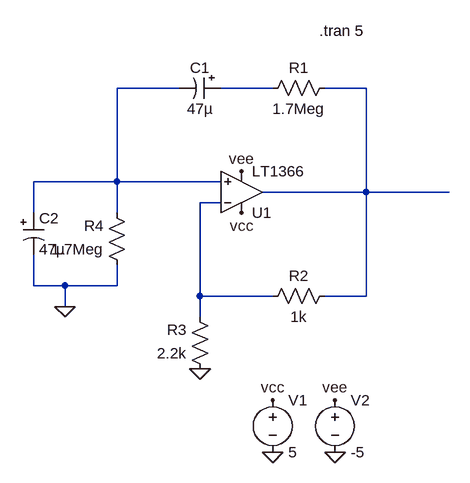
[diagram p0: schematic Draft34.asc]
Draft34.asc, the LTspice schematic file:
Version 4
SHEET 1 880 736
WIRE 304 160 208 160
WIRE 448 160 368 160
WIRE 592 160 528 160
WIRE 208 304 208 160
WIRE 208 304 80 304
WIRE 368 304 208 304
WIRE 592 320 592 160
WIRE 592 320 432 320
WIRE 720 320 592 320
WIRE 368 336 336 336
WIRE 80 352 80 304
WIRE 208 352 208 304
WIRE 80 464 80 416
WIRE 128 464 80 464
WIRE 208 464 208 432
WIRE 208 464 128 464
WIRE 336 480 336 336
WIRE 448 480 336 480
WIRE 592 480 592 320
WIRE 592 480 528 480
WIRE 128 496 128 464
WIRE 336 512 336 480
FLAG 336 592 0
FLAG 128 496 0
FLAG 544 720 0
FLAG 448 720 0
FLAG 448 640 vcc
FLAG 544 640 vee
FLAG 400 352 vcc
FLAG 400 288 vee
SYMBOL Opamps/LT1366 400 384 M180
SYMATTR InstName U1
SYMBOL res 544 144 R90
WINDOW 0 0 56 VBottom 2
WINDOW 3 32 56 VTop 2
SYMATTR InstName R1
SYMATTR Value 1.7Meg
SYMBOL res 544 464 R90
WINDOW 0 0 56 VBottom 2
WINDOW 3 32 56 VTop 2
SYMATTR InstName R2
SYMATTR Value 1k
SYMBOL res 352 608 R180
WINDOW 0 36 76 Left 2
WINDOW 3 36 40 Left 2
SYMATTR InstName R3
SYMATTR Value 2.2k
SYMBOL res 224 448 R180
WINDOW 0 36 76 Left 2
WINDOW 3 36 40 Left 2
SYMATTR InstName R4
SYMATTR Value 1.7Meg
SYMBOL polcap 368 144 R90
WINDOW 0 0 32 VBottom 2
WINDOW 3 32 32 VTop 2
SYMATTR InstName C1
SYMATTR Value 47µ
SYMBOL polcap 64 352 R0
SYMATTR InstName C2
SYMATTR Value 47µ
SYMBOL voltage 448 624 R0
SYMATTR InstName V1
SYMATTR Value 5
SYMBOL voltage 544 624 R0
SYMATTR InstName V2
SYMATTR Value -5
TEXT 520 72 Left 2 !.tran 5

The netlist it stands for:
* Draft34.asc
XU1 N001 N004 vcc vee N003 LT1366  ; pins In+ In- V+ V- OUT
R1 N003 N002 1.7Meg
R2 N003 N004 1k
R3 0 N004 2.2k
R4 0 N001 1.7Meg
C1 N002 N001 47µ
C2 N001 0 47µ
V1 vcc 0 5
V2 vee 0 -5
.tran 5
.lib LTC.lib
.backanno
.end